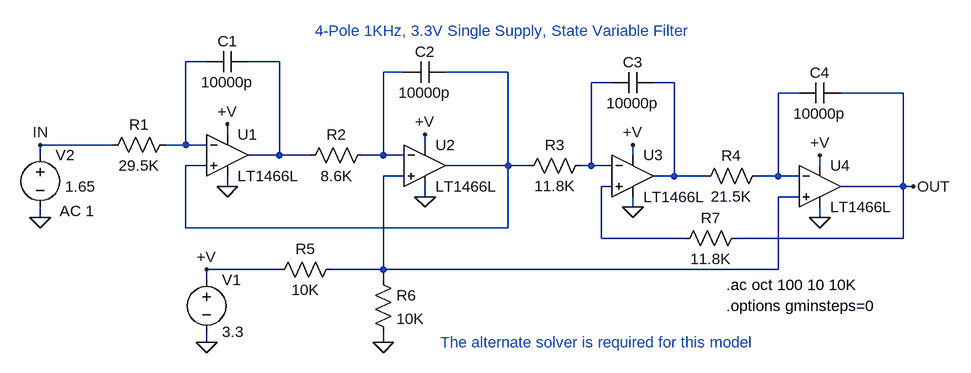
[diagram p0: schematic 1466L.asc]
1466L.asc, the LTspice schematic file:
Version 4
SHEET 1 1388 720
WIRE 224 -32 192 -32
WIRE 336 -32 288 -32
WIRE 528 -16 496 -16
WIRE 688 -16 592 -16
WIRE 848 0 816 0
WIRE 944 0 912 0
WIRE 1136 16 1104 16
WIRE 1296 16 1200 16
WIRE 256 80 256 64
WIRE 80 96 -32 96
WIRE 192 96 192 -32
WIRE 192 96 160 96
WIRE 224 96 192 96
WIRE 560 96 560 80
WIRE -32 112 -32 96
WIRE 336 112 336 -32
WIRE 336 112 288 112
WIRE 384 112 336 112
WIRE 496 112 496 -16
WIRE 496 112 464 112
WIRE 528 112 496 112
WIRE 880 112 880 96
WIRE 224 128 192 128
WIRE 688 128 688 -16
WIRE 688 128 592 128
WIRE 720 128 688 128
WIRE 816 128 816 0
WIRE 816 128 800 128
WIRE 848 128 816 128
WIRE 1168 128 1168 112
WIRE 528 144 496 144
WIRE 944 144 944 0
WIRE 944 144 912 144
WIRE 992 144 944 144
WIRE 1104 144 1104 16
WIRE 1104 144 1072 144
WIRE 1136 144 1104 144
WIRE 256 160 256 144
WIRE 848 160 832 160
WIRE 1296 160 1296 16
WIRE 1296 160 1200 160
WIRE 1312 160 1296 160
WIRE 560 176 560 160
WIRE 1136 176 1104 176
WIRE 880 192 880 176
WIRE -32 208 -32 192
WIRE 1168 208 1168 192
WIRE 192 224 192 128
WIRE 688 224 688 128
WIRE 688 224 192 224
WIRE 832 240 832 160
WIRE 960 240 832 240
WIRE 1296 240 1296 160
WIRE 1296 240 1040 240
WIRE 336 288 224 288
WIRE 496 288 496 144
WIRE 496 288 416 288
WIRE 1104 288 1104 176
WIRE 1104 288 496 288
WIRE 224 304 224 288
WIRE 496 304 496 288
WIRE 224 400 224 384
WIRE 496 400 496 384
FLAG 224 400 0
FLAG 256 64 +V
FLAG 224 288 +V
FLAG 1312 160 OUT
FLAG -32 96 IN
FLAG -32 208 0
FLAG 560 80 +V
FLAG 880 96 +V
FLAG 1168 112 +V
FLAG 256 160 0
FLAG 560 176 0
FLAG 880 192 0
FLAG 1168 208 0
FLAG 496 400 0
SYMBOL voltage 224 288 R0
SYMATTR InstName V1
SYMATTR Value 3.3
SYMBOL res 176 80 R90
WINDOW 0 0 56 VBottom 0
WINDOW 3 32 56 VTop 0
SYMATTR InstName R1
SYMATTR Value 29.5K
SYMBOL voltage -32 96 R0
WINDOW 123 30 102 Left 0
WINDOW 39 0 0 Left 0
WINDOW 3 38 64 Left 0
SYMATTR Value2 AC 1
SYMATTR InstName V2
SYMATTR Value 1.65
SYMBOL cap 288 -48 R90
WINDOW 0 0 32 VBottom 0
WINDOW 3 32 32 VTop 0
SYMATTR InstName C1
SYMATTR Value 10000p
SYMBOL res 480 96 R90
WINDOW 0 0 56 VBottom 0
WINDOW 3 32 56 VTop 0
SYMATTR InstName R2
SYMATTR Value 8.6K
SYMBOL cap 592 -32 R90
WINDOW 0 0 32 VBottom 0
WINDOW 3 32 32 VTop 0
SYMATTR InstName C2
SYMATTR Value 10000p
SYMBOL res 816 112 R90
WINDOW 0 0 56 VBottom 0
WINDOW 3 32 56 VTop 0
SYMATTR InstName R3
SYMATTR Value 11.8K
SYMBOL cap 912 -16 R90
WINDOW 0 0 32 VBottom 0
WINDOW 3 32 32 VTop 0
SYMATTR InstName C3
SYMATTR Value 10000p
SYMBOL res 1088 128 R90
WINDOW 0 0 56 VBottom 0
WINDOW 3 32 56 VTop 0
SYMATTR InstName R4
SYMATTR Value 21.5K
SYMBOL cap 1200 0 R90
WINDOW 0 0 32 VBottom 0
WINDOW 3 32 32 VTop 0
SYMATTR InstName C4
SYMATTR Value 10000p
SYMBOL res 432 272 R90
WINDOW 0 0 56 VBottom 0
WINDOW 3 32 56 VTop 0
SYMATTR InstName R5
SYMATTR Value 10K
SYMBOL res 480 288 R0
SYMATTR InstName R6
SYMATTR Value 10K
SYMBOL res 1056 224 R90
WINDOW 0 0 56 VBottom 0
WINDOW 3 32 56 VTop 0
SYMATTR InstName R7
SYMATTR Value 11.8K
SYMBOL opamps\\LT1466L 256 48 R0
SYMATTR InstName U1
SYMBOL opamps\\LT1466L 560 64 R0
SYMATTR InstName U2
SYMBOL opamps\\LT1466L 880 80 R0
SYMATTR InstName U3
SYMBOL opamps\\LT1466L 1168 96 R0
SYMATTR InstName U4
TEXT 1024 312 Left 0 !.ac oct 100 10 10K
TEXT 680 -64 Bottom 0 ;4-Pole 1KHz, 3.3V Single Supply, State Variable Filter
TEXT 1024 344 Left 0 !.options gminsteps=0
TEXT 584 400 Left 0 ;The alternate solver is required for this model

The netlist it stands for:
* 1466L.asc
V1 +V 0 3.3
R1 N001 IN 29.5K
V2 IN 0 1.65 AC 1
C1 N002 N001 10000p
R2 N003 N002 8.6K
C2 N004 N003 10000p
R3 N005 N004 11.8K
C3 N006 N005 10000p
R4 N007 N006 21.5K
C4 OUT N007 10000p
R5 N008 +V 10K
R6 N008 0 10K
R7 OUT N009 11.8K
XU1 N004 N001 +V 0 N002 LT1466L  ; pins In+ In- V+ V- OUT
XU2 N008 N003 +V 0 N004 LT1466L  ; pins In+ In- V+ V- OUT
XU3 N009 N005 +V 0 N006 LT1466L  ; pins In+ In- V+ V- OUT
XU4 N008 N007 +V 0 OUT LT1466L  ; pins In+ In- V+ V- OUT
.ac oct 100 10 10K
* 4-Pole 1KHz, 3.3V Single Supply, State Variable Filter
.options gminsteps=0
* The alternate solver is required for this model
.backanno
.end